# Altium schematic sheet TDesktop.schDoc: LiveDesign Evaluation - Video Windows
size A3; Organization: Altium Limited; Address1: L3, 12a Rodborough Rd; Address2: Frenchs Forest; Address3: NSW; Address4: Australia 2086; DocumentNumber: 7; SheetNumber: 7; SheetTotal: 20
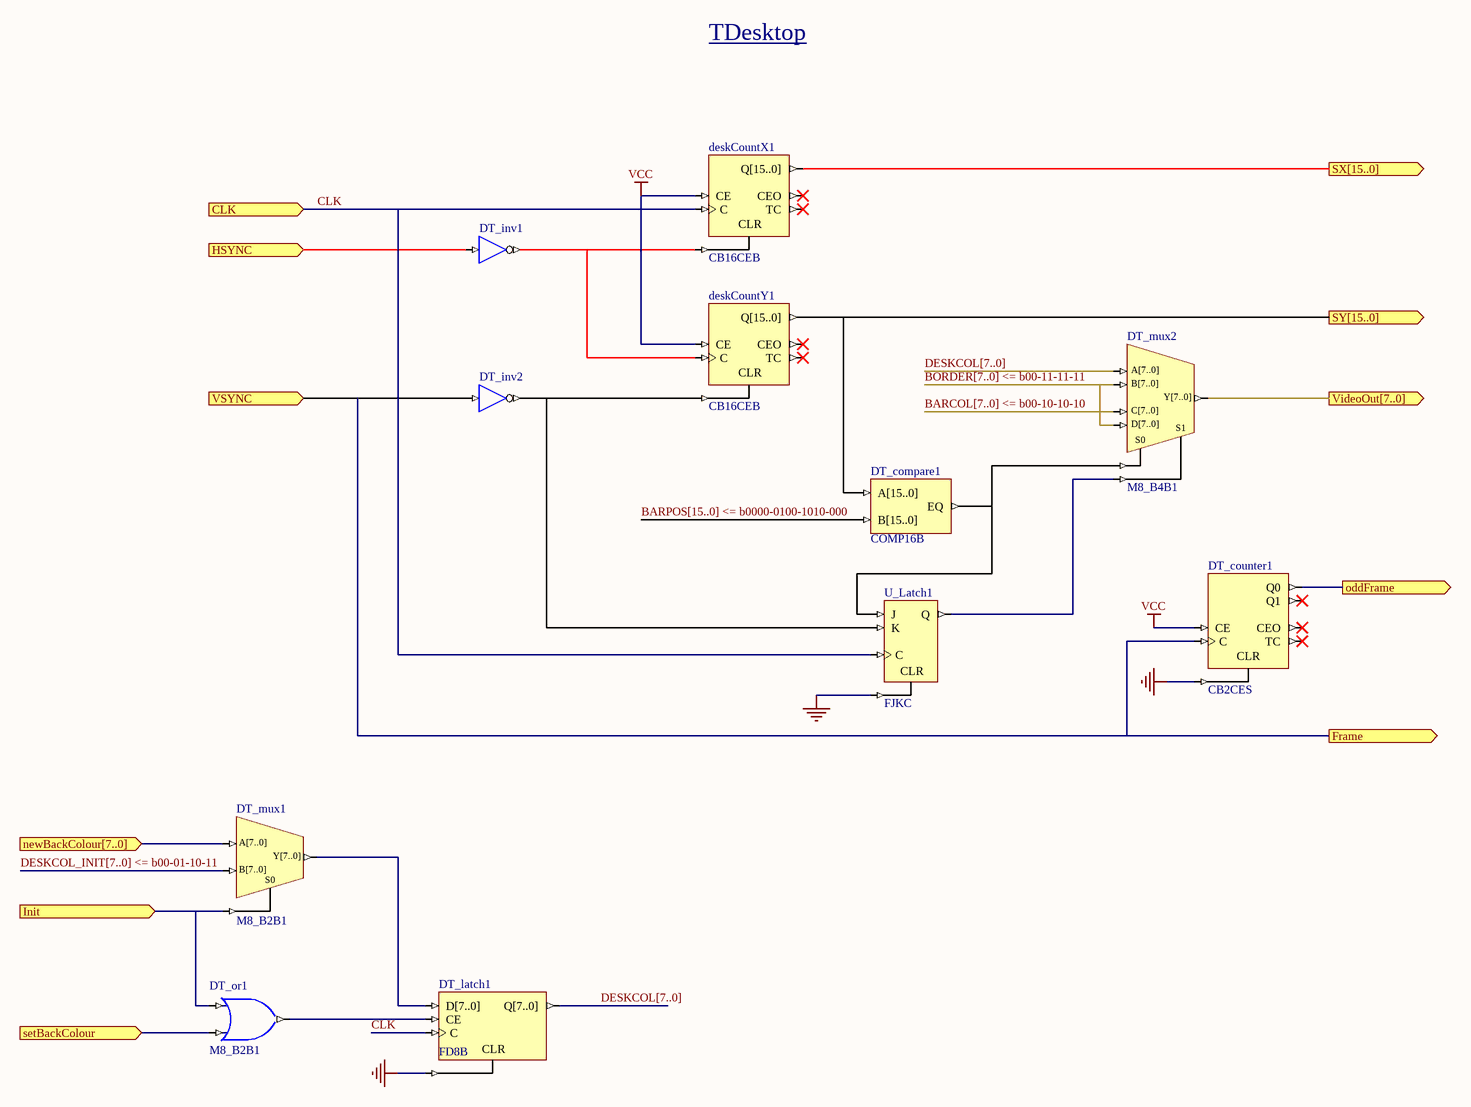
[diagram p0: TDesktop.schDoc]

## Parts
deskCountX1  CB16CEB
deskCountY1  CB16CEB
DT_compare1  COMP16B
DT_counter1  CB2CES
DT_inv1  INV  (value not drawn)
DT_inv2  BUF  (value not drawn)
DT_latch1  FD8B
DT_mux1  M8_B2B1
DT_mux2  M8_B4B1
DT_or1  M8_B2B1
U_Latch1  FJKC

## Ports
CLK (in), Frame (out), HSYNC (in), Init (in), newBackColour[7..0] (in), oddFrame (out), setBackColour (in), SX[15..0] (out), SY[15..0] (out), VideoOut[7..0] (out), VSYNC (in)

## Nets
GND: DT_counter1.CLR DT_latch1.CLR U_Latch1.CLR
VCC: deskCountX1.CE deskCountY1.CE DT_counter1.CE
BARCOL[7..0] <= b00-10-10-10: DT_mux2.C[7..0]
BARPOS[15..0] <= b0000-0100-1010-000: DT_compare1.B[15..0]
BORDER[7..0] <= b00-11-11-11: DT_mux2.B[7..0] DT_mux2.D[7..0]
CLK: deskCountX1.C DT_latch1.C U_Latch1.C ; port CLK
DESKCOL[7..0]: DT_latch1.Q[7..0] DT_mux2.A[7..0]
DESKCOL_INIT[7..0] <= b00-01-10-11: DT_mux1.B[7..0]
Frame: DT_counter1.C DT_inv2.I ; port VSYNC, port Frame
HSYNC: DT_inv1.I ; port HSYNC
Init: DT_mux1.S0 DT_or1.I0 ; port Init
newBackColour[7..0]: DT_mux1.A[7..0] ; port newBackColour[7..0]
oddFrame: DT_counter1.Q0 ; port oddFrame
setBackColour: DT_or1.I1 ; port setBackColour
SX[15..0]: deskCountX1.Q[15..0] ; port SX[15..0]
SY[15..0]: deskCountY1.Q[15..0] DT_compare1.A[15..0] ; port SY[15..0]
VideoOut[7..0]: DT_mux2.Y[7..0] ; port VideoOut[7..0]
NetdeskCountX1_CLR: deskCountX1.CLR deskCountY1.C DT_inv1.O
NetdeskCountY1_CLR: deskCountY1.CLR DT_inv2.O U_Latch1.K
NetDT_compare1_EQ: DT_compare1.EQ DT_mux2.S0 U_Latch1.J
NetDT_latch1_CE: DT_latch1.CE DT_or1.O
NetDT_latch1_D[7..0]: DT_latch1.D[7..0] DT_mux1.Y[7..0]
NetDT_mux2_S1: DT_mux2.S1 U_Latch1.Q

Not connected (* = marked no-connect by the designer): deskCountX1 CEO* TC*; deskCountY1 CEO* TC*; DT_counter1 CEO* Q1* TC*

## Buses and harness runs
bus BARCOL[7..0] <= b00-10-10-10
bus BARPOS[15..0] <= b0000-0100-1010-000
bus BORDER[7..0] <= b00-11-11-11
bus DESKCOL[7..0]
bus DESKCOL_INIT[7..0] <= b00-01-10-11

## Notes on the sheet
- TDesktop
- Title
- Size:
- Date:
- A3
- Number:
- Time:
- Revision:
- Sheet
- of
- File:

## Library data of the parts
deskCountX1 deskCountY1 = CB16CEB: 16-Bit Cascadable Binary Counters with Clock Enable and Asynchronous Clear, Bus Version; Xilinx Equivalent: CB16CE; ArchiveName: GENERIC; Published: 9-30-2003; Publisher: Altium Limited; Core Revision: 1.00.00
DT_compare1 = COMP16B: 16-Bit Identity Comparator, Bus Version; Xilinx Equivalent: COMP16; ArchiveName: GENERIC; Published: 9-30-2003; Publisher: Altium Limited; Core Revision: 1.00.00
DT_counter1 = CB2CES: 2-Bit Cascadable Binary Counters with Clock Enable and Asynchronous Clear, Single Pin Version; Xilinx Equivalent: CB2CE; ArchiveName: GENERIC; Published: 9-30-2003; Publisher: Altium Limited; Core Revision: 1.00.00
DT_inv1 DT_inv2 = INV: Inverter; ArchiveName: GENERIC; Published: 9-30-2003; Publisher: Altium Limited; Xilinx Equivalent: INV; Core Revision: 1.00.00
DT_latch1 = FD8CEB: 8-Bit D-Type Flip-Flop with Clock Enable and Asynchronous Clear, Bus Version; Xilinx Equivalent: FD8CE; ArchiveName: GENERIC; Published: 9-30-2003; Publisher: Altium Limited; Core Revision: 1.00.00
DT_mux1 = M8_B2B1: 2x8-Bit Bus to 1x8-Bit Bus Multiplexer; ArchiveName: GENERIC; Published: 9-30-2003; Publisher: Altium Limited; Core Revision: 1.00.00
DT_mux2 = M8_B4B1: 4x8-Bit Bus to 1x8-Bit Bus Multiplexer; ArchiveName: GENERIC; Published: 9-30-2003; Publisher: Altium Limited; Core Revision: 1.00.00
DT_or1 = OR2S: 2-Input OR Gate, Single Pin Version; Xilinx Equivalent: OR2; ArchiveName: GENERIC; Published: 9-30-2003; Publisher: Altium Limited; Core Revision: 1.00.00
U_Latch1 = FJKC: J-K Flip-Flop with Asynchronous Clear; ArchiveName: GENERIC; Published: 9-30-2003; Publisher: Altium Limited; Xilinx Equivalent: FJKC; Core Revision: 1.00.00